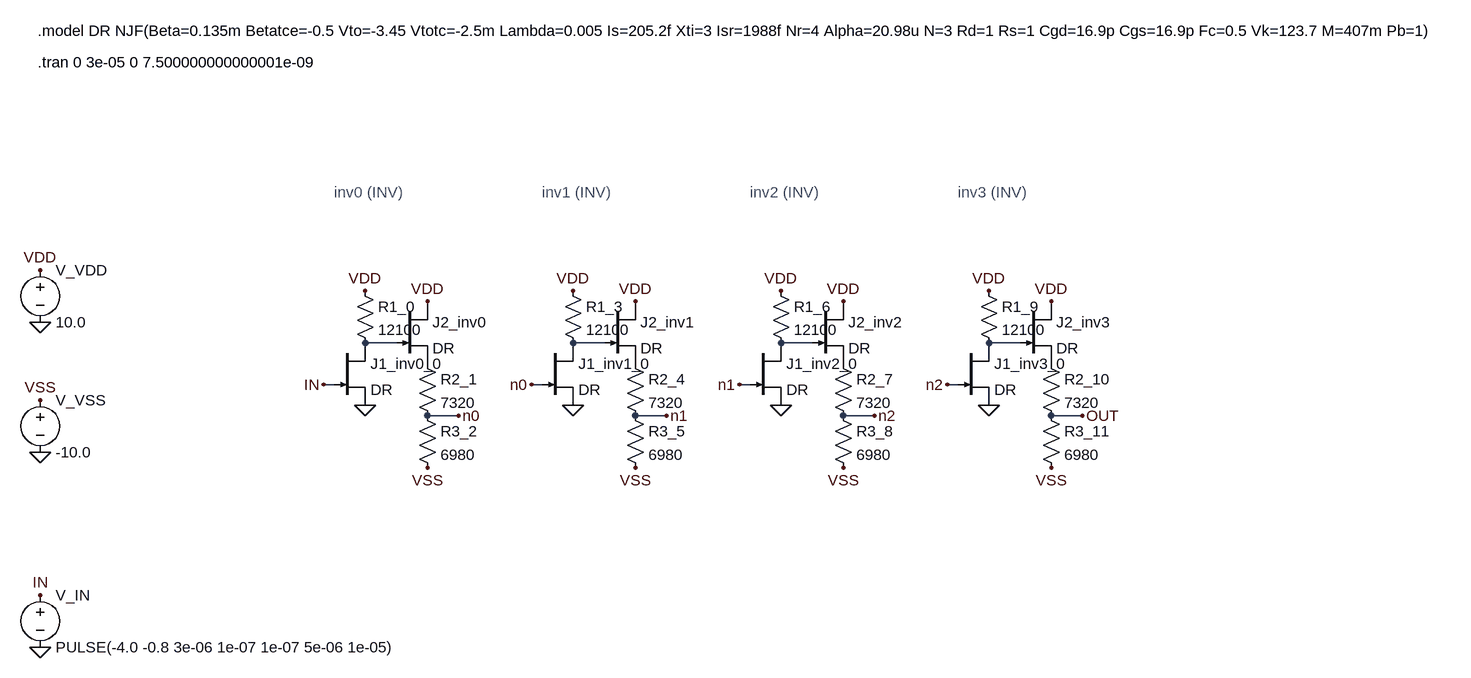
[diagram p0: schematic inv_chain_4_v4.asc]
inv_chain_4_v4.asc, the LTspice schematic file:
Version 4
SHEET 1 10000 10000
WIRE 48 128 0 128
WIRE -48 192 -64 192
WIRE 144 240 96 240
FLAG 0 48 VDD
FLAG 96 64 VDD
FLAG 144 240 n0
FLAG 96 320 VSS
FLAG 0 224 0
FLAG -64 192 IN
SYMBOL res -16 32 R0
SYMATTR InstName R1_0
SYMATTR Value 12100
SYMBOL njf -48 128 R0
SYMATTR InstName J1_inv0_0
SYMATTR Value DR
SYMBOL njf 48 64 R0
SYMATTR InstName J2_inv0
SYMATTR Value DR
SYMBOL res 80 144 R0
SYMATTR InstName R2_1
SYMATTR Value 7320
SYMBOL res 80 224 R0
SYMATTR InstName R3_2
SYMATTR Value 6980
TEXT -48 -104 Left 2 ;inv0 (INV)
WIRE 368 128 320 128
WIRE 272 192 256 192
WIRE 464 240 416 240
FLAG 320 48 VDD
FLAG 416 64 VDD
FLAG 464 240 n1
FLAG 416 320 VSS
FLAG 320 224 0
FLAG 256 192 n0
SYMBOL res 304 32 R0
SYMATTR InstName R1_3
SYMATTR Value 12100
SYMBOL njf 272 128 R0
SYMATTR InstName J1_inv1_0
SYMATTR Value DR
SYMBOL njf 368 64 R0
SYMATTR InstName J2_inv1
SYMATTR Value DR
SYMBOL res 400 144 R0
SYMATTR InstName R2_4
SYMATTR Value 7320
SYMBOL res 400 224 R0
SYMATTR InstName R3_5
SYMATTR Value 6980
TEXT 272 -104 Left 2 ;inv1 (INV)
WIRE 688 128 640 128
WIRE 592 192 576 192
WIRE 784 240 736 240
FLAG 640 48 VDD
FLAG 736 64 VDD
FLAG 784 240 n2
FLAG 736 320 VSS
FLAG 640 224 0
FLAG 576 192 n1
SYMBOL res 624 32 R0
SYMATTR InstName R1_6
SYMATTR Value 12100
SYMBOL njf 592 128 R0
SYMATTR InstName J1_inv2_0
SYMATTR Value DR
SYMBOL njf 688 64 R0
SYMATTR InstName J2_inv2
SYMATTR Value DR
SYMBOL res 720 144 R0
SYMATTR InstName R2_7
SYMATTR Value 7320
SYMBOL res 720 224 R0
SYMATTR InstName R3_8
SYMATTR Value 6980
TEXT 592 -104 Left 2 ;inv2 (INV)
WIRE 1008 128 960 128
WIRE 912 192 896 192
WIRE 1104 240 1056 240
FLAG 960 48 VDD
FLAG 1056 64 VDD
FLAG 1104 240 OUT
FLAG 1056 320 VSS
FLAG 960 224 0
FLAG 896 192 n2
SYMBOL res 944 32 R0
SYMATTR InstName R1_9
SYMATTR Value 12100
SYMBOL njf 912 128 R0
SYMATTR InstName J1_inv3_0
SYMATTR Value DR
SYMBOL njf 1008 64 R0
SYMATTR InstName J2_inv3
SYMATTR Value DR
SYMBOL res 1040 144 R0
SYMATTR InstName R2_10
SYMATTR Value 7320
SYMBOL res 1040 224 R0
SYMATTR InstName R3_11
SYMATTR Value 6980
TEXT 912 -104 Left 2 ;inv3 (INV)
FLAG -500 16 VDD
FLAG -500 96 0
SYMBOL voltage -500 0 R0
SYMATTR InstName V_VDD
SYMATTR Value 10.0
FLAG -500 216 VSS
FLAG -500 296 0
SYMBOL voltage -500 200 R0
SYMATTR InstName V_VSS
SYMATTR Value -10.0
FLAG -500 516 IN
FLAG -500 596 0
SYMBOL voltage -500 500 R0
SYMATTR InstName V_IN
SYMATTR Value PULSE(-4.0 -0.8 3e-06 1e-07 1e-07 5e-06 1e-05)
TEXT -504 -304 Left 2 !.tran 0 3e-05 0 7.500000000000001e-09
TEXT -504 -352 Left 2 !.model DR NJF(Beta=0.135m Betatce=-0.5 Vto=-3.45 Vtotc=-2.5m Lambda=0.005 Is=205.2f Xti=3 Isr=1988f Nr=4 Alpha=20.98u N=3 Rd=1 Rs=1 Cgd=16.9p Cgs=16.9p Fc=0.5 Vk=123.7 M=407m Pb=1)

The netlist it stands for:
* inv_chain_4_v4.asc
R1_0 VDD N001 12100
J1_inv0_0 N001 IN 0 DR
J2_inv0 VDD N001 P001 DR
R2_1 P001 n0 7320
R3_2 n0 VSS 6980
R1_3 VDD N002 12100
J1_inv1_0 N002 n0 0 DR
J2_inv1 VDD N002 P002 DR
R2_4 P002 n1 7320
R3_5 n1 VSS 6980
R1_6 VDD N003 12100
J1_inv2_0 N003 n1 0 DR
J2_inv2 VDD N003 P003 DR
R2_7 P003 n2 7320
R3_8 n2 VSS 6980
R1_9 VDD N004 12100
J1_inv3_0 N004 n2 0 DR
J2_inv3 VDD N004 P004 DR
R2_10 P004 OUT 7320
R3_11 OUT VSS 6980
V_VDD VDD 0 10.0
V_VSS VSS 0 -10.0
V_IN IN 0 PULSE(-4.0 -0.8 3e-06 1e-07 1e-07 5e-06 1e-05)
.model NJF NJF
.model PJF PJF
.lib standard.jft
* inv0 (INV)
* inv1 (INV)
* inv2 (INV)
* inv3 (INV)
.tran 0 3e-05 0 7.500000000000001e-09
.model DR NJF(Beta=0.135m Betatce=-0.5 Vto=-3.45 Vtotc=-2.5m Lambda=0.005 Is=205.2f Xti=3 Isr=1988f Nr=4 Alpha=20.98u N=3 Rd=1 Rs=1 Cgd=16.9p Cgs=16.9p Fc=0.5 Vk=123.7 M=407m Pb=1)
.backanno
.end